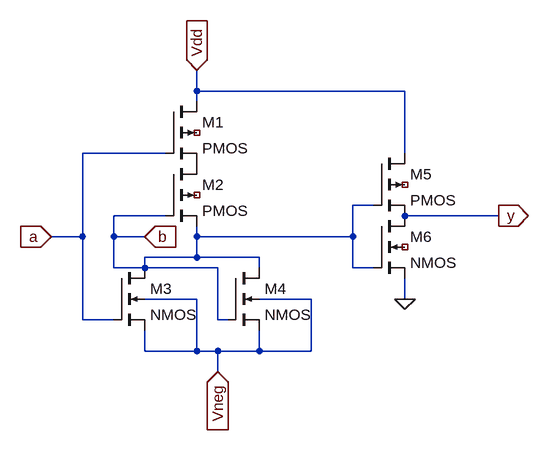
[diagram p0: schematic orsymb.asc]
orsymb.asc, the LTspice schematic file:
Version 4
SHEET 1 1276 680
WIRE 752 112 752 80
WIRE 1072 112 752 112
WIRE 752 128 752 112
WIRE 704 208 576 208
WIRE 1072 208 1072 112
WIRE 1024 288 992 288
WIRE 704 304 624 304
WIRE 1216 304 1072 304
WIRE 576 336 576 208
WIRE 576 336 528 336
WIRE 624 336 624 304
WIRE 672 336 624 336
WIRE 752 336 752 320
WIRE 992 336 992 288
WIRE 992 336 752 336
WIRE 752 368 752 336
WIRE 752 368 672 368
WIRE 848 368 752 368
WIRE 624 384 624 336
WIRE 672 384 672 368
WIRE 672 384 624 384
WIRE 784 384 672 384
WIRE 848 384 848 368
WIRE 992 384 992 336
WIRE 1024 384 992 384
WIRE 752 432 672 432
WIRE 928 432 848 432
WIRE 1072 432 1072 400
WIRE 576 464 576 336
WIRE 624 464 576 464
WIRE 784 464 784 384
WIRE 800 464 784 464
WIRE 672 512 672 480
WIRE 752 512 752 432
WIRE 752 512 672 512
WIRE 784 512 752 512
WIRE 848 512 848 480
WIRE 848 512 784 512
WIRE 928 512 928 432
WIRE 928 512 848 512
WIRE 784 544 784 512
FLAG 1072 432 0
FLAG 1216 304 y
IOPIN 1216 304 Out
FLAG 528 336 a
IOPIN 528 336 In
FLAG 672 336 b
IOPIN 672 336 In
FLAG 752 80 Vdd
IOPIN 752 80 In
FLAG 784 544 Vneg
IOPIN 784 544 In
SYMBOL pmos4 704 128 R0
SYMATTR InstName M1
SYMBOL pmos4 704 224 R0
SYMATTR InstName M2
SYMBOL nmos4 624 384 R0
SYMATTR InstName M3
SYMBOL nmos4 800 384 R0
SYMATTR InstName M4
SYMBOL pmos4 1024 208 R0
SYMATTR InstName M5
SYMBOL nmos4 1024 304 R0
SYMATTR InstName M6

The netlist it stands for:
* orsymb.asc
M1 Vdd a P001 NC_01 PMOS
M2 P001 b b NC_02 PMOS
M3 b a Vneg Vneg NMOS
M4 b b Vneg Vneg NMOS
M5 Vdd b y NC_03 PMOS
M6 y b 0 NC_04 NMOS
.model NMOS NMOS
.model PMOS PMOS
.lib standard.mos
.backanno
.end